# Altium project VIDB.PrjPcb
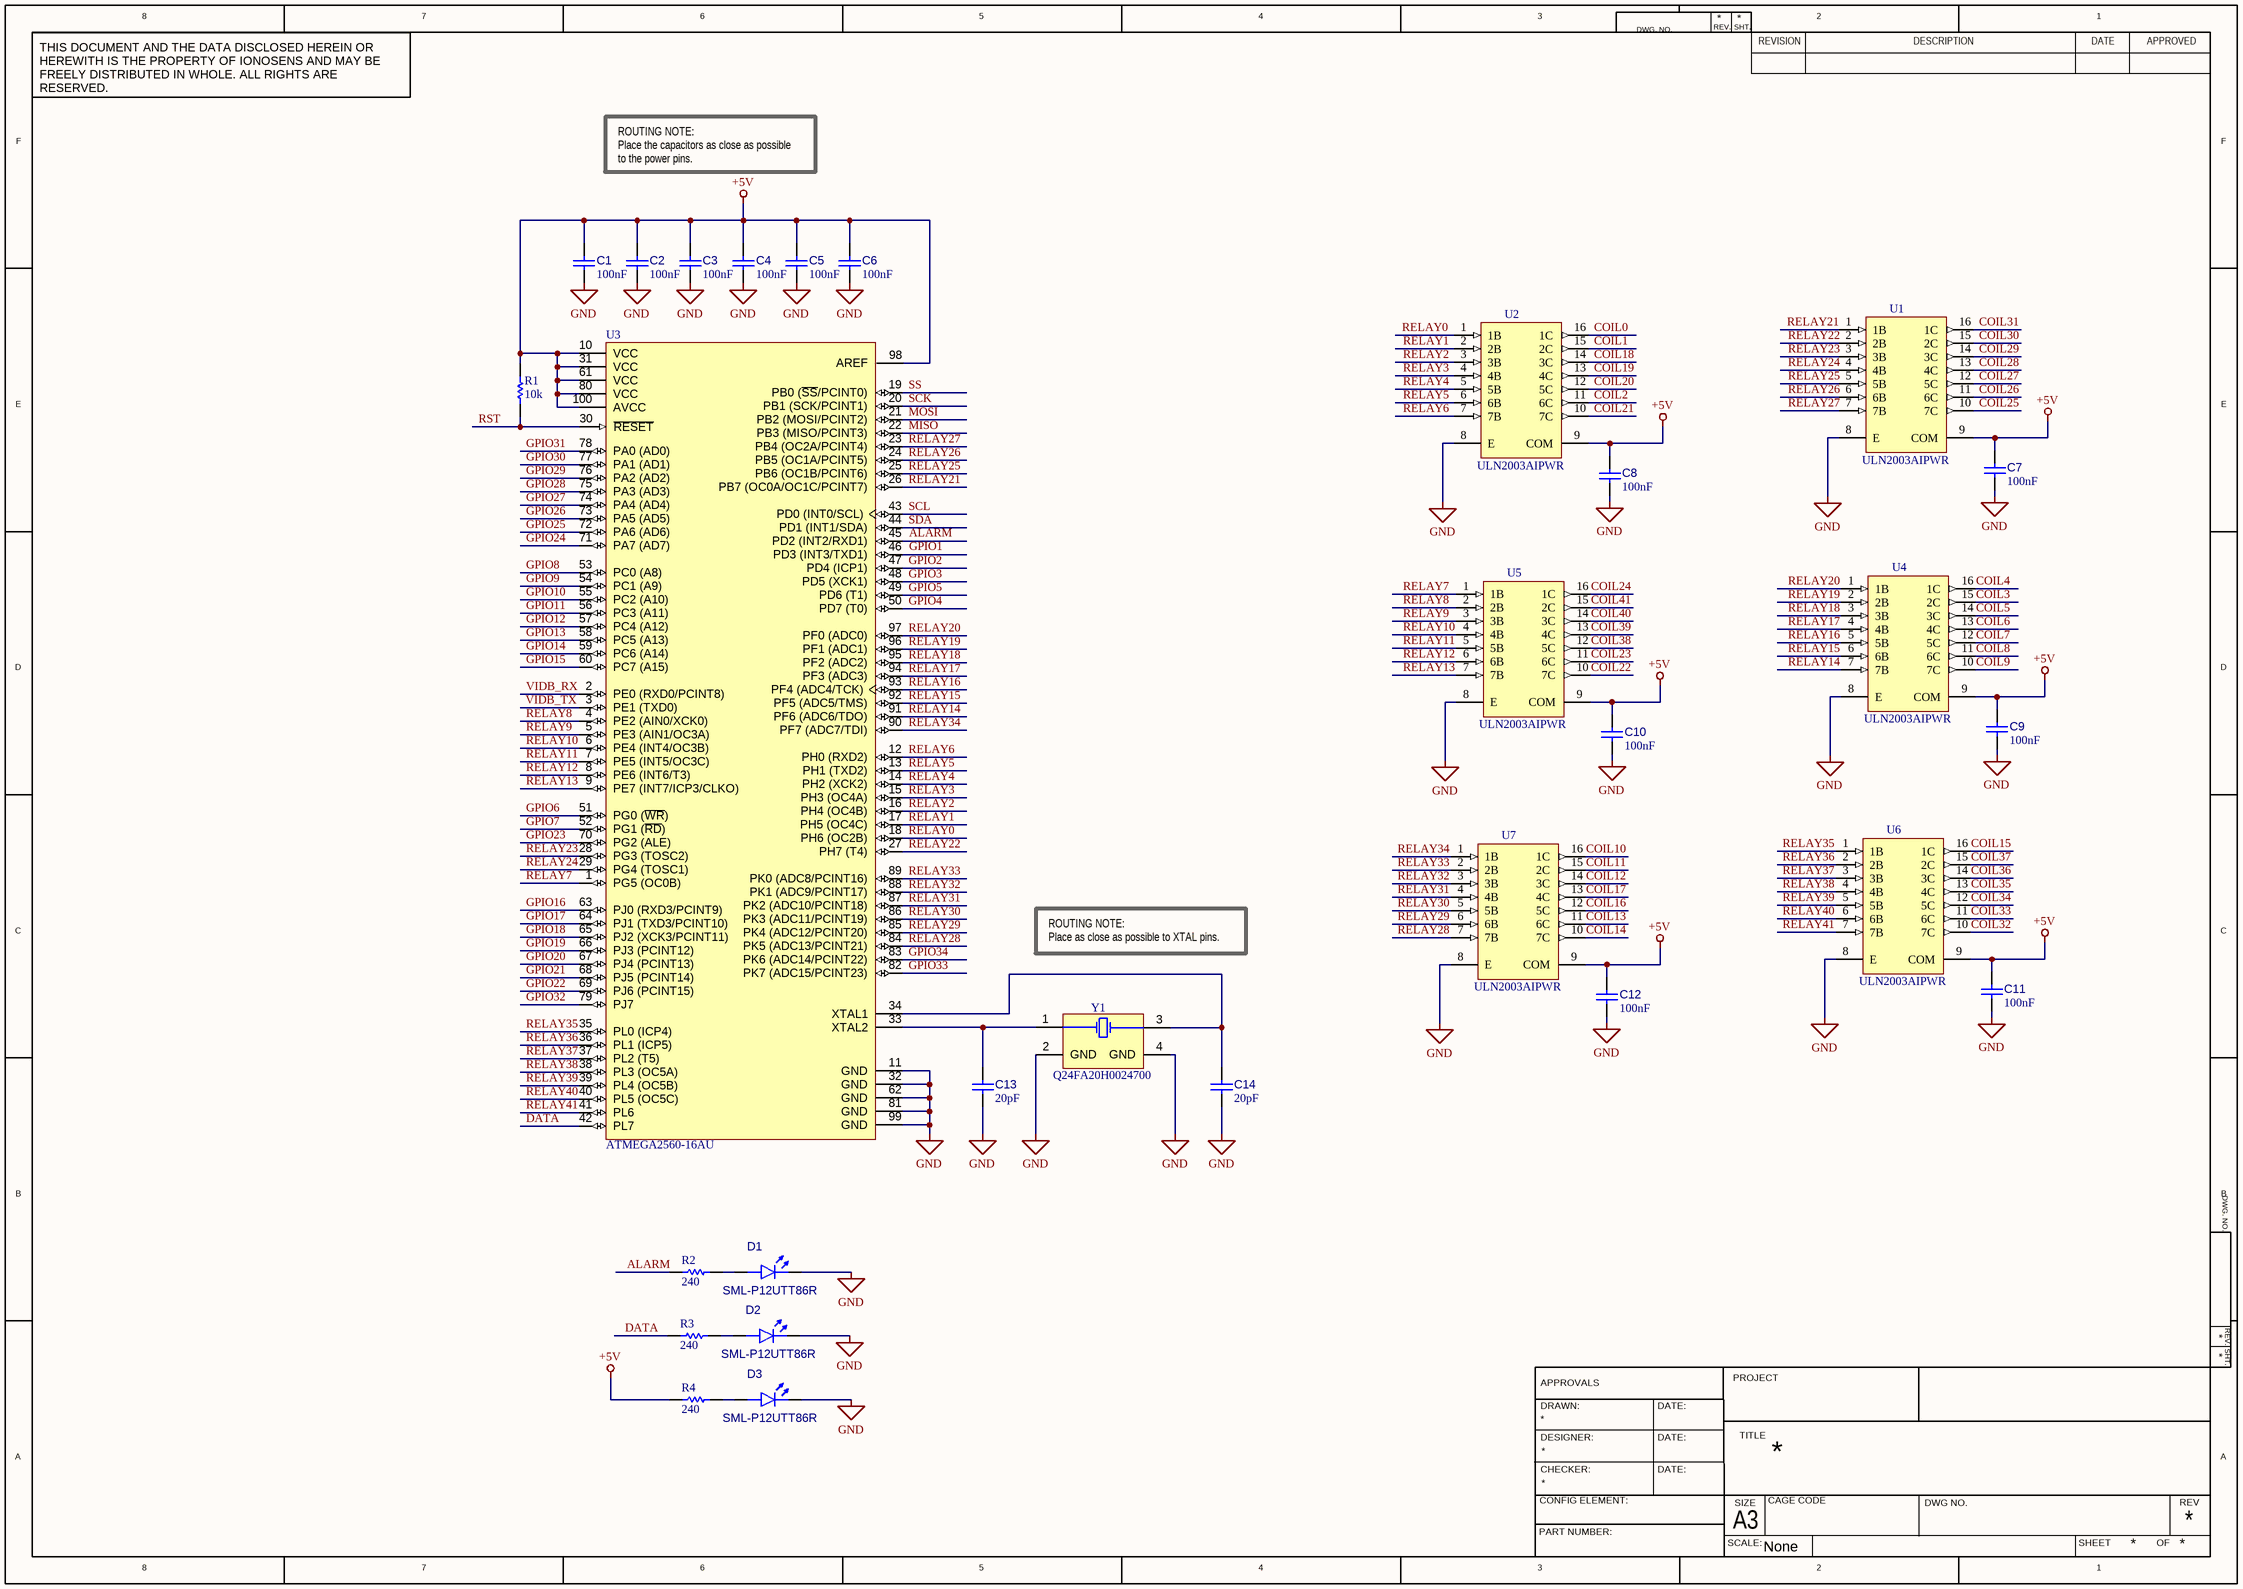
[diagram p0: Sheet1.SchDoc]
4 sheets, 168 parts. Net scope: global (net labels, ports and power ports of the same name join across sheets).
Board file: PCB1.PcbDoc
Sheets:
  Sheet1.SchDoc
  Sheet2.SchDoc
  Sheet4.SchDoc
  Sheet3.SchDoc

## Sheet Sheet1.SchDoc
size 420 x 297 mm; Scale: None

### Parts
C1  value 100nF  [CAPC1005X06M]  (hidden comment: CC0402JRX7R7BB104)
C2  value 100nF  [CAPC1005X06M]  (hidden comment: CC0402JRX7R7BB104)
C3  value 100nF  [CAPC1005X06M]  (hidden comment: CC0402JRX7R7BB104)
C4  value 100nF  [CAPC1005X06M]  (hidden comment: CC0402JRX7R7BB104)
C5  value 100nF  [CAPC1005X06M]  (hidden comment: CC0402JRX7R7BB104)
C6  value 100nF  [CAPC1005X06M]  (hidden comment: CC0402JRX7R7BB104)
C7  value 100nF  [CAPC1005X06M]  (hidden comment: CC0402JRX7R7BB104)
C8  value 100nF  [CAPC1005X06M]  (hidden comment: CC0402JRX7R7BB104)
C9  value 100nF  [CAPC1005X06M]  (hidden comment: CC0402JRX7R7BB104)
C10  value 100nF  [CAPC1005X06M]  (hidden comment: CC0402JRX7R7BB104)
C11  value 100nF  [CAPC1005X06M]  (hidden comment: CC0402JRX7R7BB104)
C12  value 100nF  [CAPC1005X06M]  (hidden comment: CC0402JRX7R7BB104)
C13  value 20pF  [CAPC1005X06M]  (hidden comment: CC0402JRNPO9BN200)
C14  value 20pF  [CAPC1005X06M]  (hidden comment: CC0402JRNPO9BN200)
D1  SML-P12UTT86R  [DIOC1005X02R]
D2  SML-P12UTT86R  [DIOC1005X02R]
D3  SML-P12UTT86R  [DIOC1005X02R]
R1  value 10k  [RESC1005X04M]  (hidden comment: AC0402FR-0710KL)
R2  value 240  [RESC1005X04M]  (hidden comment: AC0402FR-07240RL)
R3  value 240  [RESC1005X04M]  (hidden comment: AC0402FR-07240RL)
R4  value 240  [RESC1005X04M]  (hidden comment: AC0402FR-07240RL)
U1  ULN2003AIPWR  [TSOP65P640X120-16M]
U2  ULN2003AIPWR  [TSOP65P640X120-16M]
U3  ATMEGA2560-16AU  [ATML-100A_M]
U4  ULN2003AIPWR  [TSOP65P640X120-16M]
U5  ULN2003AIPWR  [TSOP65P640X120-16M]
U6  ULN2003AIPWR  [TSOP65P640X120-16M]
U7  ULN2003AIPWR  [TSOP65P640X120-16M]
Y1  Q24FA20H0024700  [FA-20H]

### Nets
+5V: C1.2 C2.2 C3.2 C4.2 C5.2 C6.2 C7.2 C8.2 C9.2 C10.2 C11.2 C12.2 R1.2 R4.1 U1.9(COM) U2.9(COM) U3.10(VCC) U3.31(VCC) U3.61(VCC) U3.80(VCC) U3.98(AREF) U3.100(AVCC) U4.9(COM) U5.9(COM) U6.9(COM) U7.9(COM)
GND: C1.1 C2.1 C3.1 C4.1 C5.1 C6.1 C7.1 C8.1 C9.1 C10.1 C11.1 C12.1 C13.1 C14.1 D1.1(K) D2.1(K) D3.1(K) U1.8(E) U2.8(E) U3.11(GND) U3.32(GND) U3.62(GND) U3.81(GND) U3.99(GND) U4.8(E) U5.8(E) U6.8(E) U7.8(E) Y1.2(GND) Y1.4(GND)
ALARM: R2.1 U3.45(PD2_(INT2/RXD1))
COIL0: U2.16(1C)
COIL1: U2.15(2C)
COIL2: U2.11(6C)
COIL3: U4.15(2C)
COIL4: U4.16(1C)
COIL5: U4.14(3C)
COIL6: U4.13(4C)
COIL7: U4.12(5C)
COIL8: U4.11(6C)
COIL9: U4.10(7C)
COIL10: U7.16(1C)
COIL11: U7.15(2C)
COIL12: U7.14(3C)
COIL13: U7.11(6C)
COIL14: U7.10(7C)
COIL15: U6.16(1C)
COIL16: U7.12(5C)
COIL17: U7.13(4C)
COIL18: U2.14(3C)
COIL19: U2.13(4C)
COIL20: U2.12(5C)
COIL21: U2.10(7C)
COIL22: U5.10(7C)
COIL23: U5.11(6C)
COIL24: U5.16(1C)
COIL25: U1.10(7C)
COIL26: U1.11(6C)
COIL27: U1.12(5C)
COIL28: U1.13(4C)
COIL29: U1.14(3C)
COIL30: U1.15(2C)
COIL31: U1.16(1C)
COIL32: U6.10(7C)
COIL33: U6.11(6C)
COIL34: U6.12(5C)
COIL35: U6.13(4C)
COIL36: U6.14(3C)
COIL37: U6.15(2C)
COIL38: U5.12(5C)
COIL39: U5.13(4C)
COIL40: U5.14(3C)
COIL41: U5.15(2C)
DATA: R3.1 U3.42(PL7)
GPIO1: U3.46(PD3_(INT3/TXD1))
GPIO2: U3.47(PD4_(ICP1))
GPIO3: U3.48(PD5_(XCK1))
GPIO4: U3.50(PD7_(T0))
GPIO5: U3.49(PD6_(T1))
GPIO6: U3.51(PG0_(~{WR}))
GPIO7: U3.52(PG1_(~{RD}))
GPIO8: U3.53(PC0_(A8))
GPIO9: U3.54(PC1_(A9))
GPIO10: U3.55(PC2_(A10))
GPIO11: U3.56(PC3_(A11))
GPIO12: U3.57(PC4_(A12))
GPIO13: U3.58(PC5_(A13))
GPIO14: U3.59(PC6_(A14))
GPIO15: U3.60(PC7_(A15))
GPIO16: U3.63(PJ0_(RXD3/PCINT9))
GPIO17: U3.64(PJ1_(TXD3/PCINT10))
GPIO18: U3.65(PJ2_(XCK3/PCINT11))
GPIO19: U3.66(PJ3_(PCINT12))
GPIO20: U3.67(PJ4_(PCINT13))
GPIO21: U3.68(PJ5_(PCINT14))
GPIO22: U3.69(PJ6_(PCINT15))
GPIO23: U3.70(PG2_(ALE))
GPIO24: U3.71(PA7_(AD7))
GPIO25: U3.72(PA6_(AD6))
GPIO26: U3.73(PA5_(AD5))
GPIO27: U3.74(PA4_(AD4))
GPIO28: U3.75(PA3_(AD3))
GPIO29: U3.76(PA2_(AD2))
GPIO30: U3.77(PA1_(AD1))
GPIO31: U3.78(PA0_(AD0))
GPIO32: U3.79(PJ7)
GPIO33: U3.82(PK7_(ADC15/PCINT23))
GPIO34: U3.83(PK6_(ADC14/PCINT22))
MISO: U3.22(PB3_(MISO/PCINT3))
MOSI: U3.21(PB2_(MOSI/PCINT2))
RELAY0: U2.1(1B) U3.18(PH6_(OC2B))
RELAY1: U2.2(2B) U3.17(PH5_(OC4C))
RELAY2: U2.3(3B) U3.16(PH4_(OC4B))
RELAY3: U2.4(4B) U3.15(PH3_(OC4A))
RELAY4: U2.5(5B) U3.14(PH2_(XCK2))
RELAY5: U2.6(6B) U3.13(PH1_(TXD2))
RELAY6: U2.7(7B) U3.12(PH0_(RXD2))
RELAY7: U3.1(PG5_(OC0B)) U5.1(1B)
RELAY8: U3.4(PE2_(AIN0/XCK0)) U5.2(2B)
RELAY9: U3.5(PE3_(AIN1/OC3A)) U5.3(3B)
RELAY10: U3.6(PE4_(INT4/OC3B)) U5.4(4B)
RELAY11: U3.7(PE5_(INT5/OC3C)) U5.5(5B)
RELAY12: U3.8(PE6_(INT6/T3)) U5.6(6B)
RELAY13: U3.9(PE7_(INT7/ICP3/CLKO)) U5.7(7B)
RELAY14: U3.91(PF6_(ADC6/TDO)) U4.7(7B)
RELAY15: U3.92(PF5_(ADC5/TMS)) U4.6(6B)
RELAY16: U3.93(PF4_(ADC4/TCK)) U4.5(5B)
RELAY17: U3.94(PF3_(ADC3)) U4.4(4B)
RELAY18: U3.95(PF2_(ADC2)) U4.3(3B)
RELAY19: U3.96(PF1_(ADC1)) U4.2(2B)
RELAY20: U3.97(PF0_(ADC0)) U4.1(1B)
RELAY21: U1.1(1B) U3.26(PB7_(OC0A/OC1C/PCINT7))
RELAY22: U1.2(2B) U3.27(PH7_(T4))
RELAY23: U1.3(3B) U3.28(PG3_(TOSC2))
RELAY24: U1.4(4B) U3.29(PG4_(TOSC1))
RELAY25: U1.5(5B) U3.25(PB6_(OC1B/PCINT6))
RELAY26: U1.6(6B) U3.24(PB5_(OC1A/PCINT5))
RELAY27: U1.7(7B) U3.23(PB4_(OC2A/PCINT4))
RELAY28: U3.84(PK5_(ADC13/PCINT21)) U7.7(7B)
RELAY29: U3.85(PK4_(ADC12/PCINT20)) U7.6(6B)
RELAY30: U3.86(PK3_(ADC11/PCINT19)) U7.5(5B)
RELAY31: U3.87(PK2_(ADC10/PCINT18)) U7.4(4B)
RELAY32: U3.88(PK1_(ADC9/PCINT17)) U7.3(3B)
RELAY33: U3.89(PK0_(ADC8/PCINT16)) U7.2(2B)
RELAY34: U3.90(PF7_(ADC7/TDI)) U7.1(1B)
RELAY35: U3.35(PL0_(ICP4)) U6.1(1B)
RELAY36: U3.36(PL1_(ICP5)) U6.2(2B)
RELAY37: U3.37(PL2_(T5)) U6.3(3B)
RELAY38: U3.38(PL3_(OC5A)) U6.4(4B)
RELAY39: U3.39(PL4_(OC5B)) U6.5(5B)
RELAY40: U3.40(PL5_(OC5C)) U6.6(6B)
RELAY41: U3.41(PL6) U6.7(7B)
RST: R1.1 U3.30(~{RESET})
SCK: U3.20(PB1_(SCK/PCINT1))
SCL: U3.43(PD0_(INT0/SCL))
SDA: U3.44(PD1_(INT1/SDA))
SS: U3.19(PB0_(~{SS}/PCINT0))
VIDB_RX: U3.2(PE0_(RXD0/PCINT8))
VIDB_TX: U3.3(PE1_(TXD0))
NetC13_2: C13.2 U3.33(XTAL2) Y1.1(X1)
NetC14_2: C14.2 U3.34(XTAL1) Y1.3(X2)
NetD1_2: D1.2(A) R2.2
NetD2_2: D2.2(A) R3.2
NetD3_2: D3.2(A) R4.2

### Notes on the sheet
- ROUTING NOTE:
  Place the capacitors as close as possible to the power pins.
- ROUTING NOTE:
  Place as close as possible to XTAL pins.
- 8
- 7
- 6
- 5
- 4
- 3
- DWG. NO.
- REV.
- SHT.
- REVISION
- 2
- DESCRIPTION
- DATE
- 1
- APPROVED
- THIS DOCUMENT AND THE DATA DISCLOSED HEREIN OR HEREWITH IS THE PROPERTY OF IONOSENS AND MAY BE FREELY DISTRIBUTED IN WHOLE. ALL RIGHTS ARE RESERVED.
- F
- E
- D
- C
- B
- DRAWN:
- APPROVALS
- DATE:
- PROJECT
- A
- CHECKER:
- DESIGNER:
- TITLE
- PART NUMBER:
- CONFIG ELEMENT:
- SCALE:
- A3
- SIZE
- CAGE CODE
- DWG NO.
- SHEET
- OF
- REV

### Library data of the parts
C1-C12 = C01-0402-01-00001-1: Cap Ceramic 100nF 50V X7R 5% SMD 0402 125°C; Manufacturer: YAGEO; Voltage Rating: 16V; Case/Package: 0402; Capacitor Type: Ceramic; Min Operating Temperature: -55°C; Width: 508µm; Length: 1mm; Tolerance: 5%; Dielectric: X7R; RoHS Compliant: Yes; Pins: 2; Composition: Ceramic; Depth: 500µm; Voltage Rating (DC): 16V; Mount: Surface Mount; Mounting Technology: Surface Mount; Termination: SMD/SMT; Manufacturer P/N: CC0402JRX7R7BB104; Thickness: 558.8µm; Max Operating Temperature: 125°C
C13 C14 = C01-0402-01-00008-1: Cap Ceramic 20pF 50V C0G 5% SMD 0402 125°C; Manufacturer: YAGEO; Dielectric: COG; Case/Package: 0402; Tolerance: 5%; Thickness: 558.8µm; Termination: SMD/SMT; Manufacturer P/N: CC0402JRNPO9BN200; Voltage Rating: 50V; Length: 990.6µm; Depth: 500µm; Width: 508µm; Min Operating Temperature: -55°C; Mount: Surface Mount; Voltage Rating (DC): 50V; Pins: 2; Capacitor Type: Ceramic; RoHS Compliant: Yes; Composition: Ceramic; Mounting Technology: Surface Mount; Max Operating Temperature: 125°C
D1-D3 = D01-0402-01-00001-1: Led red 0402; Manufacturer: ROHM; Number of LEDs: 1; Max Power Dissipation: 52mW; Luminous Intensity: 85 mcd; Dominant Wavelength: 620 nm; Lens Style: Rectangular, Square; Forward Current: 20 mA; Forward Voltage: 2V; Mounting Technology: SMD; Case/Package: 0402; Min Operating Temperature: -40°C; Max Operating Temperature: 85°C; Manufacturer P/N: SML-P12UTT86R; Colour: red; RoHS Compliant: Yes; Pins: 2
R1 = R01-0402-01-00169-2: RES SMD 10K OHM 1% 1/16W 0402; Manufacturer: Yageo; Temperature Coefficient: 100 ppm/ºC; Power Rating: 62.5mW; Voltage Rating: 50V; Length: 990.6µm; Height: 370µm; Min Operating Temperature: -55°C; Case/Package: 0402; Features: Automotive AEC-Q200, Moisture Resistant; Packaging: Tape & Reel; Width: 508µm; Manufacturer P/N: AC0402FR-0710KL; RoHS: Yes; Max Operating Temperature: 155°C; Tolerance: 1%; Composition: Thick Film; Number of Terminations: 2
R2-R4 = R01-0402-01-00437-2: RES SMD 240 OHM 1% 1/16W 0402; Manufacturer: Yageo; Temperature Coefficient: 100 ppm/ºC; Power Rating: 62.5mW; Voltage Rating: 50V; Packaging: Tape & Reel; Manufacturer P/N: AC0402FR-07240RL; Height: 370µm; Case/Package: 0402; Composition: Thick Film; Max Operating Temperature: 155°C; Number of Terminations: 2; RoHS: Yes; Min Operating Temperature: -55°C; Tolerance: 1%; Width: 508µm; Length: 990.6µm; Features: Automotive AEC-Q200, Moisture Resistant
U1 U2 U4-U7 = CMP-0005-0001-00001-1: 50-V, 7-ch darlington transistor array, -40 to 105C 16-TSSOP -40 to 105; Manufacturer: Texas Instruments; Voltage Rating: 50V; Min Operating Temperature: 105°C; RoHS Compliant: yes; Pins: 16; Case/Package: TSSOP; Mounting Technology: SMD; Length: 5mm; Manufacturer P/N: ULN2003AIPWR; Height: 1.2mm; Max Operating Temperature: -40°C; Width: 4.4mm
U3 = U01-0007-01-00000-1: AVR ATmega Microcontroller 8-bit 16MHz 256KB FLASH TQFP100; Manufacturer: Microchip; Oscillator Type: External; Interface: I2C, SPI, UART; Minimum Supply Voltage: 4.5V; Peripherals: Brown-out Detect/Reset, POR, PWM, WDT; Number of A/D: 1 AD / 16 channels; Watchdog Timer: Yes; Number of I/O: 86; RAM Size: 8KB; Max Supply Voltage: 5.5V; Max Operating Temperature: 85°C; Manufacturer P/N: ATMEGA2560-16AU; Memory Size: 256KB; Mounting Technology: SMD; Memory Type: FLASH; Pins: 100; Height: 1.2mm; Case/Package: A; RoHS: Yes; Min Operating Temperature: -40°C; Max Frequency: 16MHz; Number of Programmable I/O: 86; Contact Plating: Tin; Core Architecture: AVR; Frequency: 16MHz; Width: 16.25mm
Y1 = Y01-0001-01-00000-11: 16MHz ±10ppm 16pF 80Ω SMD-2520_4P; Manufacturer: SEIKO-EPSON; ESR: 80; RoHS Compliant: yes; Min Operating Temperature: -40°C; Load Capacitance: 16pF; Mounting Technology: SMD; Pins: 4; Case/Package: SMD-2520_4P; Max Operating Temperature: 85°C; Frequency: 16MHz; Manufacturer P/N: Q24FA20H0024700

## Sheet Sheet2.SchDoc
size 420 x 297 mm
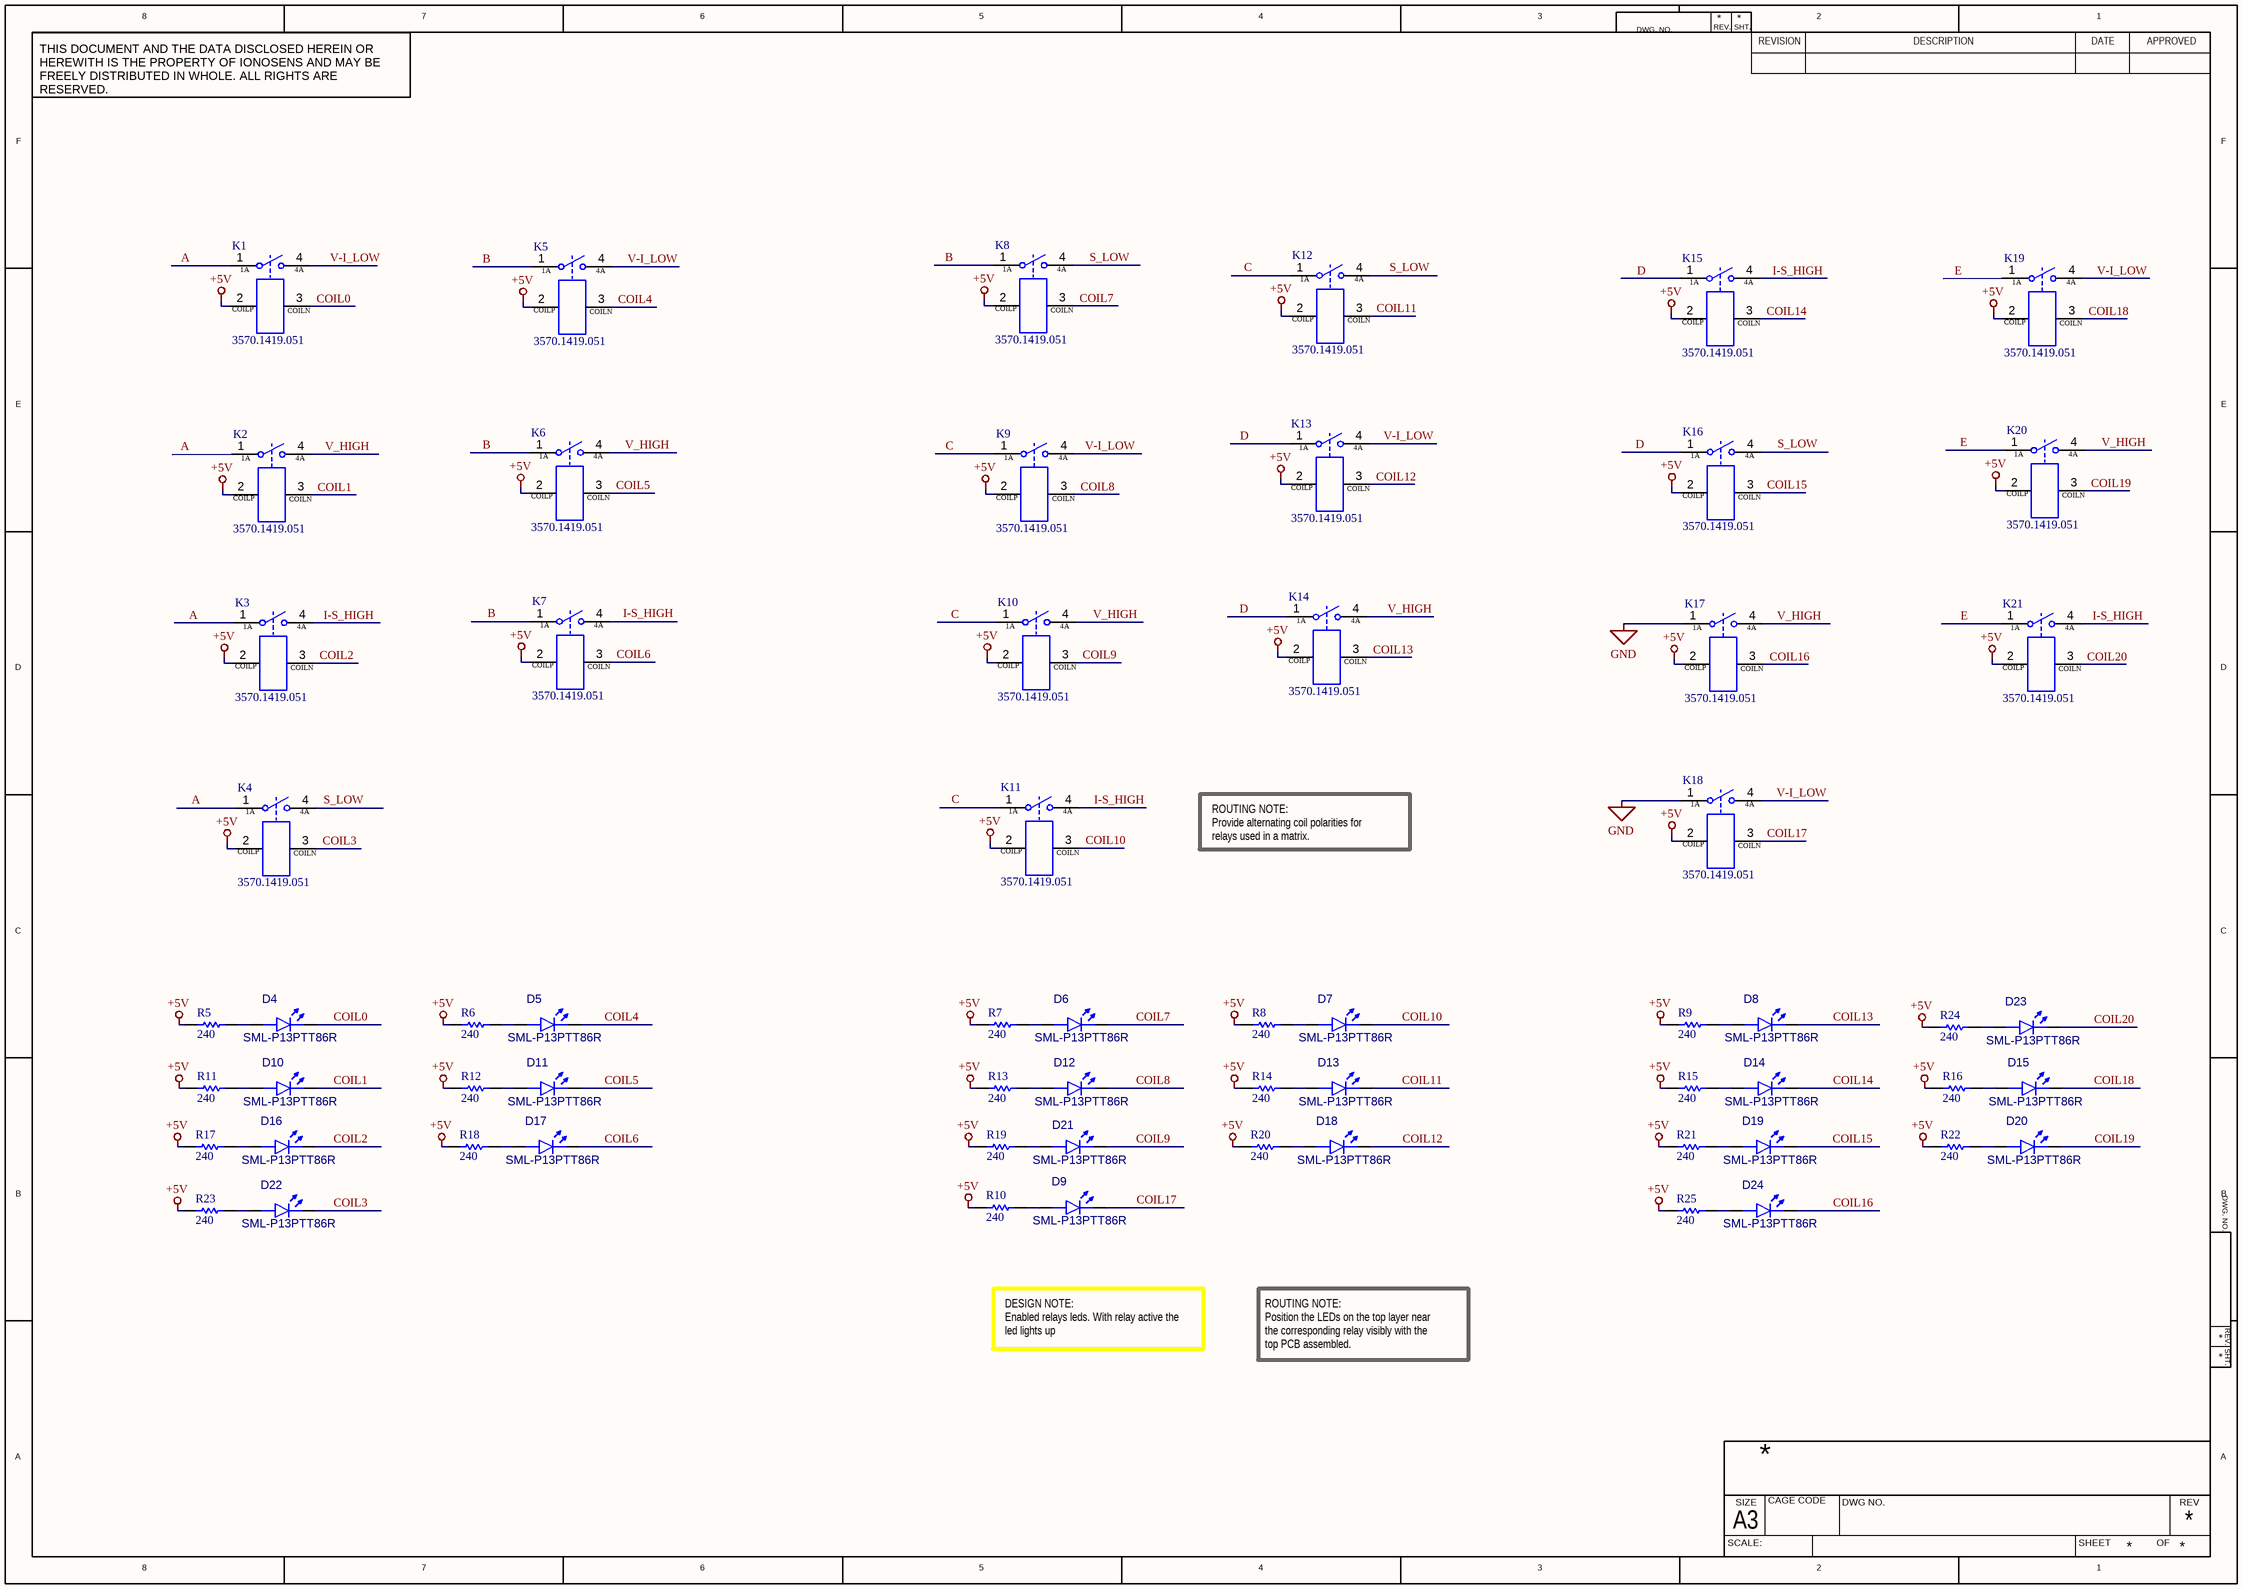
[diagram p1: Sheet2.SchDoc]

### Parts
D4  SML-P13PTT86R  [DIOC1005X02R]
D5  SML-P13PTT86R  [DIOC1005X02R]
D6  SML-P13PTT86R  [DIOC1005X02R]
D7  SML-P13PTT86R  [DIOC1005X02R]
D8  SML-P13PTT86R  [DIOC1005X02R]
D9  SML-P13PTT86R  [DIOC1005X02R]
D10  SML-P13PTT86R  [DIOC1005X02R]
D11  SML-P13PTT86R  [DIOC1005X02R]
D12  SML-P13PTT86R  [DIOC1005X02R]
D13  SML-P13PTT86R  [DIOC1005X02R]
D14  SML-P13PTT86R  [DIOC1005X02R]
D15  SML-P13PTT86R  [DIOC1005X02R]
D16  SML-P13PTT86R  [DIOC1005X02R]
D17  SML-P13PTT86R  [DIOC1005X02R]
D18  SML-P13PTT86R  [DIOC1005X02R]
D19  SML-P13PTT86R  [DIOC1005X02R]
D20  SML-P13PTT86R  [DIOC1005X02R]
D21  SML-P13PTT86R  [DIOC1005X02R]
D22  SML-P13PTT86R  [DIOC1005X02R]
D23  SML-P13PTT86R  [DIOC1005X02R]
D24  SML-P13PTT86R  [DIOC1005X02R]
K1  3570.1419.051  [3570.1419]
K2  3570.1419.051  [3570.1419]
K3  3570.1419.051  [3570.1419]
K4  3570.1419.051  [3570.1419]
K5  3570.1419.051  [3570.1419]
K6  3570.1419.051  [3570.1419]
K7  3570.1419.051  [3570.1419]
K8  3570.1419.051  [3570.1419]
K9  3570.1419.051  [3570.1419]
K10  3570.1419.051  [3570.1419]
K11  3570.1419.051  [3570.1419]
K12  3570.1419.051  [3570.1419]
K13  3570.1419.051  [3570.1419]
K14  3570.1419.051  [3570.1419]
K15  3570.1419.051  [3570.1419]
K16  3570.1419.051  [3570.1419]
K17  3570.1419.051  [3570.1419]
K18  3570.1419.051  [3570.1419]
K19  3570.1419.051  [3570.1419]
K20  3570.1419.051  [3570.1419]
K21  3570.1419.051  [3570.1419]
R5  value 240  [RESC1005X04M]  (hidden comment: AC0402FR-07240RL)
R6  value 240  [RESC1005X04M]  (hidden comment: AC0402FR-07240RL)
R7  value 240  [RESC1005X04M]  (hidden comment: AC0402FR-07240RL)
R8  value 240  [RESC1005X04M]  (hidden comment: AC0402FR-07240RL)
R9  value 240  [RESC1005X04M]  (hidden comment: AC0402FR-07240RL)
R10  value 240  [RESC1005X04M]  (hidden comment: AC0402FR-07240RL)
R11  value 240  [RESC1005X04M]  (hidden comment: AC0402FR-07240RL)
R12  value 240  [RESC1005X04M]  (hidden comment: AC0402FR-07240RL)
R13  value 240  [RESC1005X04M]  (hidden comment: AC0402FR-07240RL)
R14  value 240  [RESC1005X04M]  (hidden comment: AC0402FR-07240RL)
R15  value 240  [RESC1005X04M]  (hidden comment: AC0402FR-07240RL)
R16  value 240  [RESC1005X04M]  (hidden comment: AC0402FR-07240RL)
R17  value 240  [RESC1005X04M]  (hidden comment: AC0402FR-07240RL)
R18  value 240  [RESC1005X04M]  (hidden comment: AC0402FR-07240RL)
R19  value 240  [RESC1005X04M]  (hidden comment: AC0402FR-07240RL)
R20  value 240  [RESC1005X04M]  (hidden comment: AC0402FR-07240RL)
R21  value 240  [RESC1005X04M]  (hidden comment: AC0402FR-07240RL)
R22  value 240  [RESC1005X04M]  (hidden comment: AC0402FR-07240RL)
R23  value 240  [RESC1005X04M]  (hidden comment: AC0402FR-07240RL)
R24  value 240  [RESC1005X04M]  (hidden comment: AC0402FR-07240RL)
R25  value 240  [RESC1005X04M]  (hidden comment: AC0402FR-07240RL)

### Nets
+5V: K1.2(COILP) K2.2(COILP) K3.2(COILP) K4.2(COILP) K5.2(COILP) K6.2(COILP) K7.2(COILP) K8.2(COILP) K9.2(COILP) K10.2(COILP) K11.2(COILP) K12.2(COILP) K13.2(COILP) K14.2(COILP) K15.2(COILP) K16.2(COILP) K17.2(COILP) K18.2(COILP) K19.2(COILP) K20.2(COILP) K21.2(COILP) R5.1 R6.1 R7.1 R8.1 R9.1 R10.1 R11.1 R12.1 R13.1 R14.1 R15.1 R16.1 R17.1 R18.1 R19.1 R20.1 R21.1 R22.1 R23.1 R24.1 R25.1
GND: K17.1(1A) K18.1(1A)
A: K1.1(1A) K2.1(1A) K3.1(1A) K4.1(1A)
B: K5.1(1A) K6.1(1A) K7.1(1A) K8.1(1A)
C: K9.1(1A) K10.1(1A) K11.1(1A) K12.1(1A)
COIL0: D4.1(K) K1.3(COILN)
COIL1: D10.1(K) K2.3(COILN)
COIL2: D16.1(K) K3.3(COILN)
COIL3: D22.1(K) K4.3(COILN)
COIL4: D5.1(K) K5.3(COILN)
COIL5: D11.1(K) K6.3(COILN)
COIL6: D17.1(K) K7.3(COILN)
COIL7: D6.1(K) K8.3(COILN)
COIL8: D12.1(K) K9.3(COILN)
COIL9: D21.1(K) K10.3(COILN)
COIL10: D7.1(K) K11.3(COILN)
COIL11: D13.1(K) K12.3(COILN)
COIL12: D18.1(K) K13.3(COILN)
COIL13: D8.1(K) K14.3(COILN)
COIL14: D14.1(K) K15.3(COILN)
COIL15: D19.1(K) K16.3(COILN)
COIL16: D24.1(K) K17.3(COILN)
COIL17: D9.1(K) K18.3(COILN)
COIL18: D15.1(K) K19.3(COILN)
COIL19: D20.1(K) K20.3(COILN)
COIL20: D23.1(K) K21.3(COILN)
D: K13.1(1A) K14.1(1A) K15.1(1A) K16.1(1A)
E: K19.1(1A) K20.1(1A) K21.1(1A)
I-S_HIGH: K3.4(4A) K7.4(4A) K11.4(4A) K15.4(4A) K21.4(4A)
S_LOW: K4.4(4A) K8.4(4A) K12.4(4A) K16.4(4A)
V-I_LOW: K1.4(4A) K5.4(4A) K9.4(4A) K13.4(4A) K18.4(4A) K19.4(4A)
V_HIGH: K2.4(4A) K6.4(4A) K10.4(4A) K14.4(4A) K17.4(4A) K20.4(4A)
NetD4_2: D4.2(A) R5.2
NetD5_2: D5.2(A) R6.2
NetD6_2: D6.2(A) R7.2
NetD7_2: D7.2(A) R8.2
NetD8_2: D8.2(A) R9.2
NetD9_2: D9.2(A) R10.2
NetD10_2: D10.2(A) R11.2
NetD11_2: D11.2(A) R12.2
NetD12_2: D12.2(A) R13.2
NetD13_2: D13.2(A) R14.2
NetD14_2: D14.2(A) R15.2
NetD15_2: D15.2(A) R16.2
NetD16_2: D16.2(A) R17.2
NetD17_2: D17.2(A) R18.2
NetD18_2: D18.2(A) R20.2
NetD19_2: D19.2(A) R21.2
NetD20_2: D20.2(A) R22.2
NetD21_2: D21.2(A) R19.2
NetD22_2: D22.2(A) R23.2
NetD23_2: D23.2(A) R24.2
NetD24_2: D24.2(A) R25.2

### Notes on the sheet
- ROUTING NOTE:
  Provide alternating coil polarities for relays used in a matrix.
- DESIGN NOTE:
  Enabled relays leds. With relay active the led lights up
- ROUTING NOTE:
  Position the LEDs on the top layer near the corresponding relay visibly with the top PCB assembled.
- 8
- 7
- 6
- 5
- 4
- 3
- DWG. NO.
- REV.
- SHT.
- REVISION
- 2
- DESCRIPTION
- DATE
- 1
- APPROVED
- THIS DOCUMENT AND THE DATA DISCLOSED HEREIN OR HEREWITH IS THE PROPERTY OF IONOSENS AND MAY BE FREELY DISTRIBUTED IN WHOLE. ALL RIGHTS ARE RESERVED.
- F
- E
- D
- C
- B
- A
- SCALE:
- A3
- SIZE
- CAGE CODE
- DWG NO.
- SHEET
- OF
- REV

### Library data of the parts
D4-D24 = D01-0402-01-00000-1: Led green 0402; Manufacturer: ROHM; Forward Voltage: 2.1V; Max Power Dissipation: 52mW; Forward Current: 20 mA; Number of LEDs: 1; Dominant Wavelength: 560 nm; Luminous Intensity: 10 mcd; Lens Style: Rectangular, Square; Min Operating Temperature: -40°C; Mounting Technology: SMD; Colour: Green; Manufacturer P/N: SML-P13PTT86R; Max Operating Temperature: 85°C; Pins: 2; RoHS Compliant: Yes; Case/Package: 0402
K1-K21 = K01-0008-01-00008-1: Reed Relay, Mini SIP, 5 VDC; 1 Form A, 15W, 200 VDC, 1.25A; Manufacturer: Comus; Number of Terminal: 4; Contact Current Rating: 1A; Coil Current: 10mA; Switching Voltage: 200V; Rise time: 0s; Contact Resistence: 0.15; Coil resitence: 500; Operate Time: 350µs; Coil Voltage (DC): 5V; Insulation Resistance: 0; Release Time: 100µs; Manufacturer P/N: 3570.1419.051; Mounting Technology: TH; Contact Material: -; Relay Type: Reed; Width: 15.24mm; Contact Form: 1A; Packaging: SIP; Switching Current: 1A; Pins: 4; Case/Package: SIP; Coil Type: -; Min Operating Temperature: -40°C; RoHS: Yes; Height: 6.98mm; Max Operating Temperature: 85°C
R5-R25 = R01-0402-01-00437-2: as R2 on sheet Sheet1; Packaging: Tape & Reel; Manufacturer P/N: AC0402FR-07240RL; Height: 370µm; Case/Package: 0402; Composition: Thick Film; Max Operating Temperature: 155°C; Number of Terminations: 2; RoHS: Yes; Min Operating Temperature: -55°C; Tolerance: 1%; Width: 508µm; Length: 990.6µm; Features: Automotive AEC-Q200, Moisture Resistant

## Sheet Sheet4.SchDoc
size 420 x 297 mm
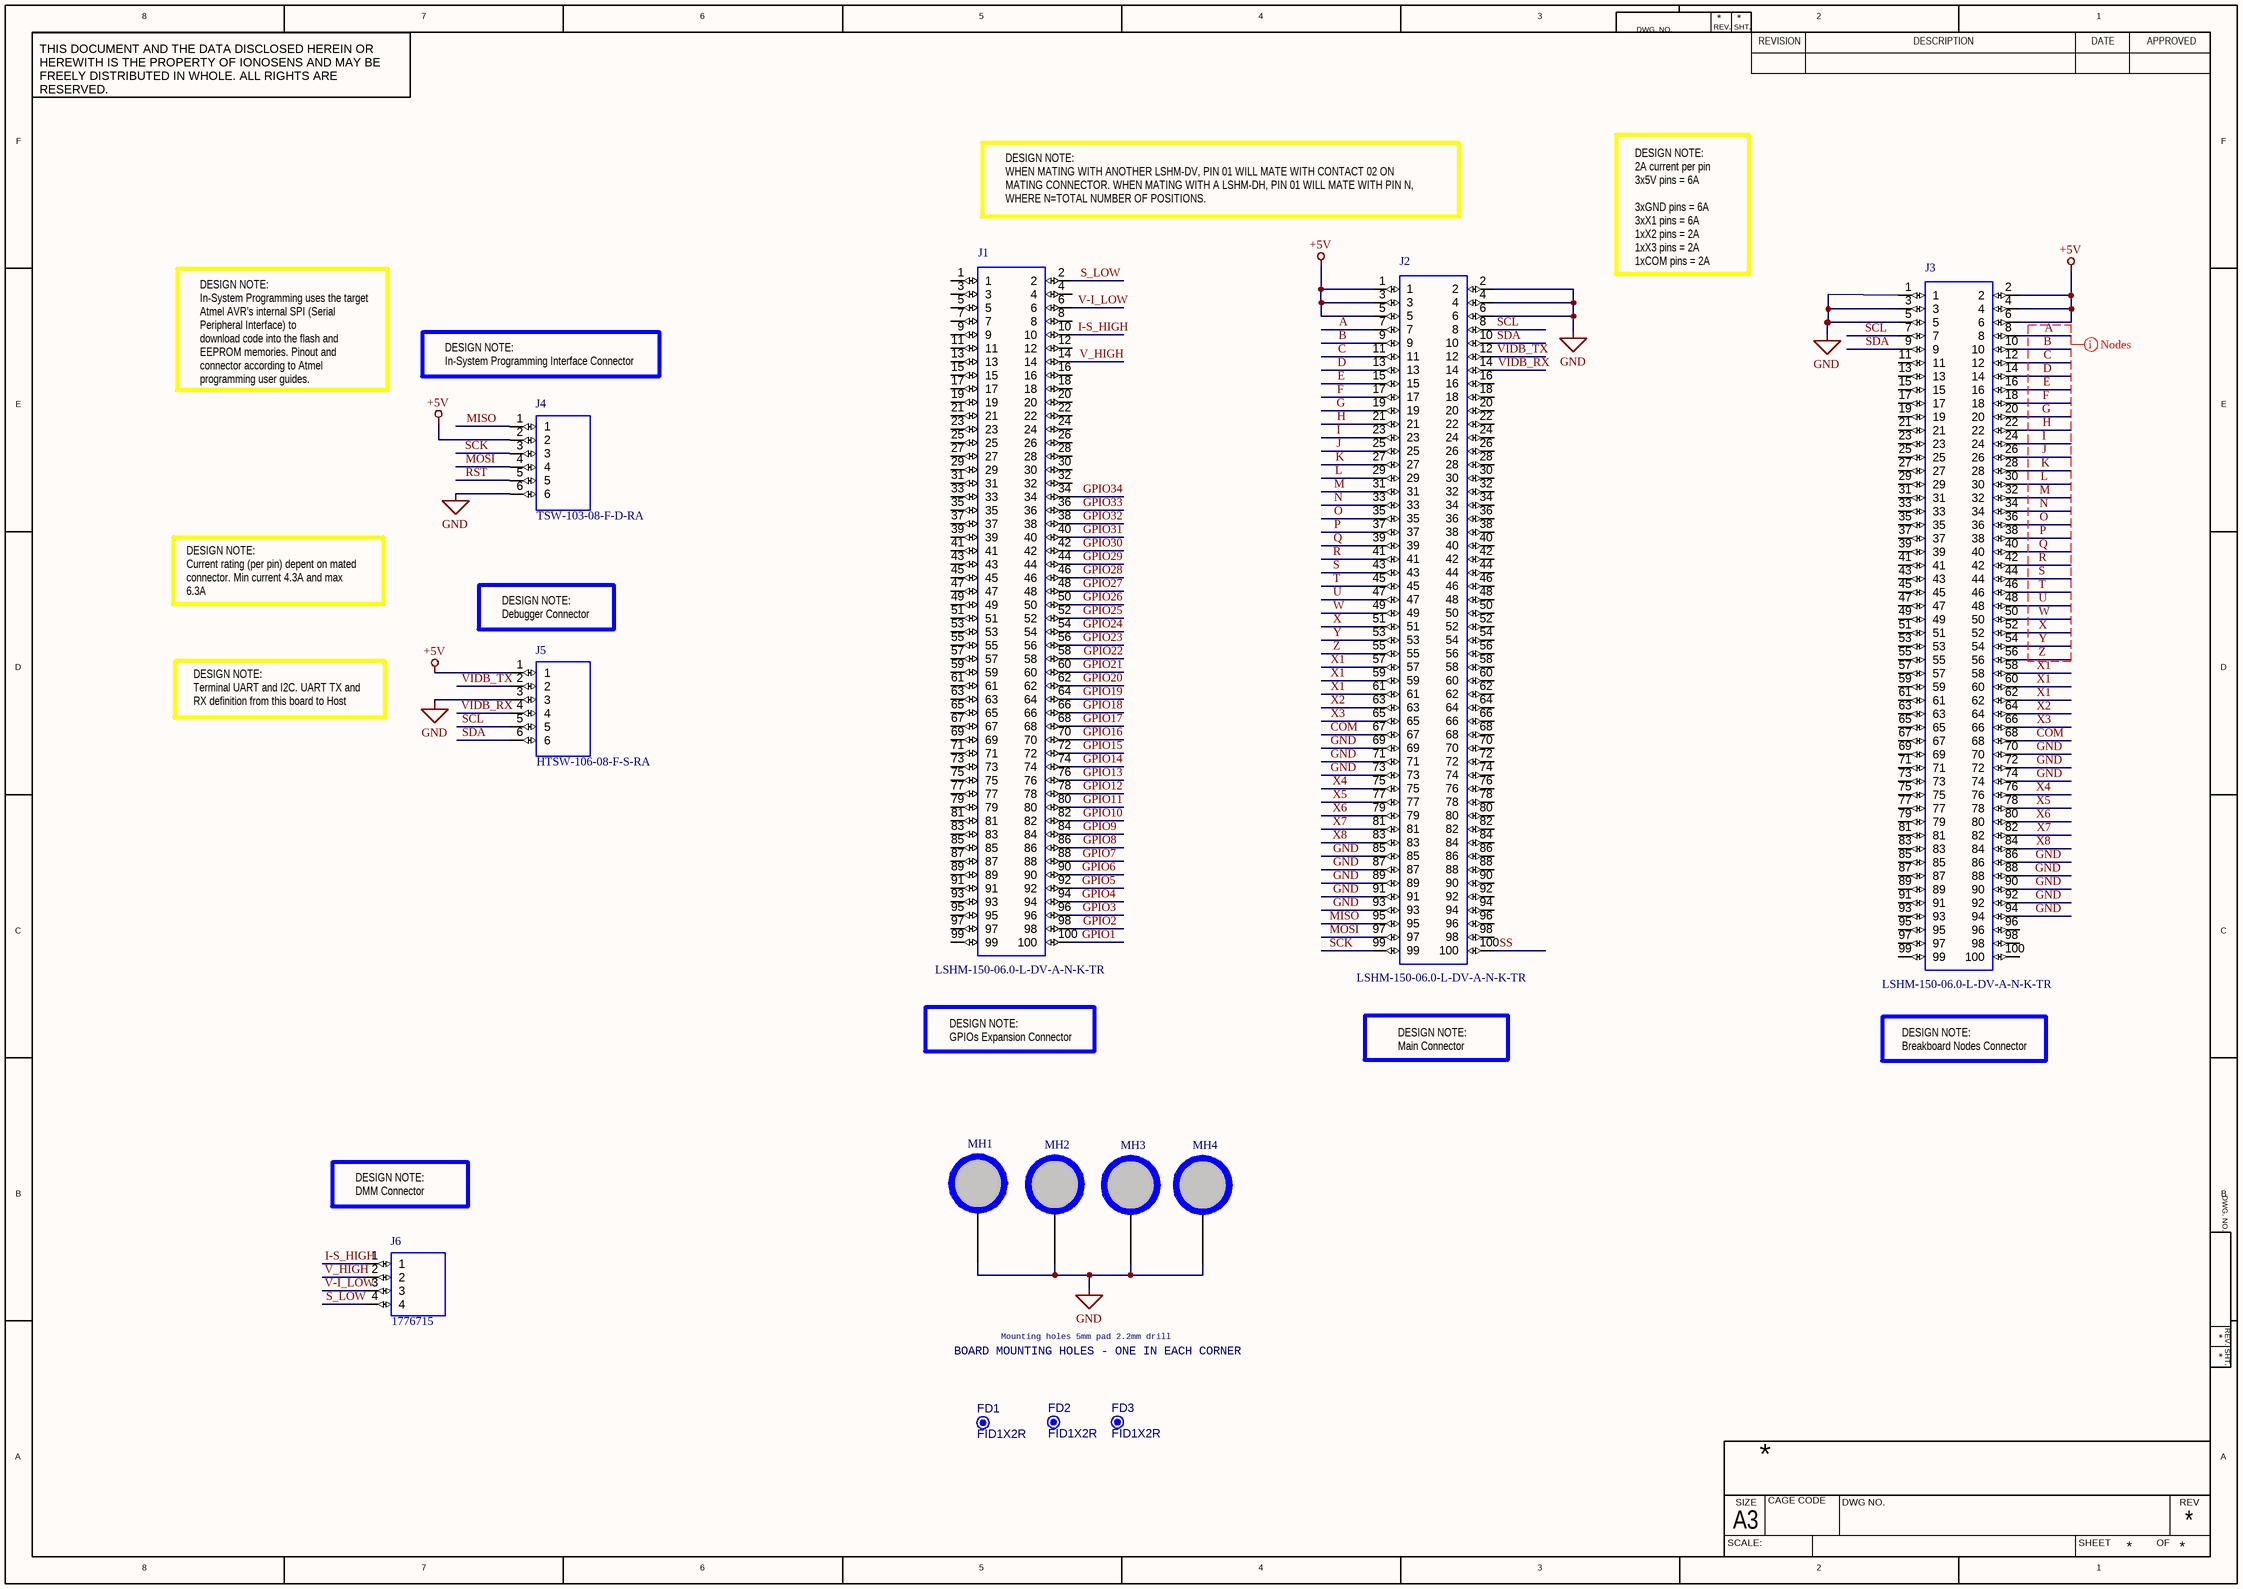
[diagram p2: Sheet4.SchDoc]

### Parts
FD1  FID1X2R  [FID1X2R]  (no BOM)
FD2  FID1X2R  [FID1X2R]  (no BOM)
FD3  FID1X2R  [FID1X2R]  (no BOM)
J1  LSHM-150-06.0-L-DV-A-N-K-TR  [LSHM_150_06_0_L_DV_A_N_K_TR]
J2  LSHM-150-06.0-L-DV-A-N-K-TR  [LSHM_150_06_0_L_DV_A_N_K_TR]
J3  LSHM-150-06.0-L-DV-A-N-K-TR  [LSHM_150_06_0_L_DV_A_N_K_TR]
J4  TSW-103-08-F-D-RA  [TSW-103-08-F-D-RA]
J5  HTSW-106-08-F-S-RA  [TSW-106-08-F-S-RA]
J6  1776715  [1776715]
MH1  C500h220  [C500h220z368]  (value not drawn)
MH2  C500h220  [C500h220z368]  (value not drawn)
MH3  C500h220  [C500h220z368]  (value not drawn)
MH4  C500h220  [C500h220z368]  (value not drawn)

### Nets
+5V: J2.1 J2.3 J2.5 J3.2 J3.4 J3.6 J4.2 J5.1
GND: J2.2 J2.4 J2.6 J2.69 J2.71 J2.73 J2.85 J2.87 J2.89 J2.91 J2.93 J3.1 J3.3 J3.5 J3.70 J3.72 J3.74 J3.86 J3.88 J3.90 J3.92 J3.94 J4.6 J5.3 MH1.1 MH2.1 MH3.1 MH4.1
A: J2.7 J3.8
B: J2.9 J3.10
C: J2.11 J3.12
COM: J2.67 J3.68
D: J2.13 J3.14
E: J2.15 J3.16
F: J2.17 J3.18
G: J2.19 J3.20
GPIO1: J1.100
GPIO2: J1.98
GPIO3: J1.96
GPIO4: J1.94
GPIO5: J1.92
GPIO6: J1.90
GPIO7: J1.88
GPIO8: J1.86
GPIO9: J1.84
GPIO10: J1.82
GPIO11: J1.80
GPIO12: J1.78
GPIO13: J1.76
GPIO14: J1.74
GPIO15: J1.72
GPIO16: J1.70
GPIO17: J1.68
GPIO18: J1.66
GPIO19: J1.64
GPIO20: J1.62
GPIO21: J1.60
GPIO22: J1.58
GPIO23: J1.56
GPIO24: J1.54
GPIO25: J1.52
GPIO26: J1.50
GPIO27: J1.48
GPIO28: J1.46
GPIO29: J1.44
GPIO30: J1.42
GPIO31: J1.40
GPIO32: J1.38
GPIO33: J1.36
GPIO34: J1.34
H: J2.21 J3.22
I: J2.23 J3.24
I-S_HIGH: J1.10 J6.1
J: J2.25 J3.26
K: J2.27 J3.28
L: J2.29 J3.30
M: J2.31 J3.32
MISO: J2.95 J4.1
MOSI: J2.97 J4.4
N: J2.33 J3.34
O: J2.35 J3.36
P: J2.37 J3.38
Q: J2.39 J3.40
R: J2.41 J3.42
RST: J4.5
S: J2.43 J3.44
S_LOW: J1.2 J6.4
SCK: J2.99 J4.3
SCL: J2.8 J3.7 J5.5
SDA: J2.10 J3.9 J5.6
SS: J2.100
T: J2.45 J3.46
U: J2.47 J3.48
V-I_LOW: J1.6 J6.3
V_HIGH: J1.14 J6.2
VIDB_RX: J2.14 J5.4
VIDB_TX: J2.12 J5.2
W: J2.49 J3.50
X: J2.51 J3.52
X1: J2.57 J2.59 J2.61 J3.58 J3.60 J3.62
X2: J2.63 J3.64
X3: J2.65 J3.66
X4: J2.75 J3.76
X5: J2.77 J3.78
X6: J2.79 J3.80
X7: J2.81 J3.82
X8: J2.83 J3.84
Y: J2.53 J3.54
Z: J2.55 J3.56

Not connected (* = marked no-connect by the designer): J1 1 3 4 5 7 8 9 11 12 13 15 16 17 18 19 20 21 22 23 24 25 26 27 28 29 30 31 32 33 35 37 39 41 43 45 47 49 51 53 55 57 59 61 63 65 67 69 71 73 75 77 79 81 83 85 87 89 91 93 95 97 99; J2 16 18 20 22 24 26 28 30 32 34 36 38 40 42 44 46 48 50 52 54 56 58 60 62 64 66 68 70 72 74 76 78 80 82 84 86 88 90 92 94 96 98; J3 11 13 15 17 19 21 23 25 27 29 31 33 35 37 39 41 43 45 47 49 51 53 55 57 59 61 63 65 67 69 71 73 75 77 79 81 83 85 87 89 91 93 95 96 97 98 99 100

### Layout directives
net class Nodes: A, B, C, D, E, F, G, H, I, J, K, L, M, N, O, P, Q, R, S, T, U, W, X, Y, Z

### Notes on the sheet
- DESIGN NOTE:
  WHEN MATING WITH ANOTHER LSHM-DV, PIN 01 WILL MATE WITH CONTACT 02 ON
  MATING CONNECTOR. WHEN MATING WITH A LSHM-DH, PIN 01 WILL MATE WITH PIN N,
  WHERE N=TOTAL NUMBER OF POSITIONS.
- DESIGN NOTE:
  2A current per pin
  3x5V pins = 6A
  3xGND pins = 6A
  3xX1 pins = 6A
  1xX2 pins = 2A
  1xX3 pins = 2A
  1xCOM pins = 2A
- DESIGN NOTE:
  In-System Programming uses the target Atmel AVR’s internal SPI (Serial Peripheral Interface) to
  download code into the flash and EEPROM memories. Pinout and connector according to Atmel programming user guides.
- DESIGN NOTE:
  In-System Programming Interface Connector
- DESIGN NOTE:
  Current rating (per pin) depent on mated connector. Min current 4.3A and max 6.3A
- (near J5) DESIGN NOTE:
  Debugger Connector
- DESIGN NOTE:
  Terminal UART and I2C. UART TX and RX definition from this board to Host
- DESIGN NOTE:
  GPIOs Expansion Connector
- DESIGN NOTE:
  Main Connector
- DESIGN NOTE:
  Breakboard Nodes Connector
- DESIGN NOTE:
  DMM Connector
- Mounting holes 5mm pad 2.2mm drill
- BOARD MOUNTING HOLES - ONE IN EACH CORNER
- 8
- 7
- 6
- 5
- 4
- 3
- DWG. NO.
- REV.
- SHT.
- REVISION
- 2
- DESCRIPTION
- DATE
- 1
- APPROVED
- THIS DOCUMENT AND THE DATA DISCLOSED HEREIN OR HEREWITH IS THE PROPERTY OF IONOSENS AND MAY BE FREELY DISTRIBUTED IN WHOLE. ALL RIGHTS ARE RESERVED.
- F
- E
- D
- C
- B
- A
- SCALE:
- A3
- SIZE
- CAGE CODE
- DWG NO.
- SHEET
- OF
- REV

### Library data of the parts
FD1-FD3 = CMP-00028-00005-2: Fiducial - Round 1x2mm; Pins: 0
J1-J3 = J01-001-01-00001-2: Conn Socket and Terminal Strip HDR/SKT 100 POS 0.5mm Solder ST SMD T/R; Manufacturer: Samtec; Gender: HERMAPHRODITIC; Pitch: 500 µm; Contact Plating: Gold; Case/Package: SMD; Max Operating Temperature: 125°C; Number of Rows: 2; RoHS Compliant: Yes; Housing Color: Black; Mounting Technology: SMD; Pins: 100; Termination: Solder; Orientation: Straight; Depth: 4.98 mm; Length: 29.7 mm; Contact Material: Bronze; Housing Material: Polymer; Min Operating Temperature: -55°C; Manufacturer P/N: LSHM-150-06.0-L-DV-A-N-K-TR
J4 = J01-001-01-00003-2: 6 Vias Pin Header 2.54mm, Right Angle; Manufacturer: Samtec; Gender: Male; Orientation: Straight; Mounting Technology: Through Hole; Contact Material: Bronze; Housing Material: Polyester; Pitch: 2.54mm; Housing Color: Black; Termination: Solder; Min Operating Temperature: -55°C; Pins: 6; Depth: 4.87 mm; RoHS Compliant: Yes; Manufacturer P/N: TSW-103-08-F-D-RA; Length: 7.62 mm; Contact Plating: Gold; Number of Rows: 2; Max Operating Temperature: 125°C; Case/Package: Through Hole
J5 = J01-001-01-00005-2: 6 Vias Pin Header 2.54mm, Right Angle, 1 Row; Manufacturer: Samtec; Gender: Male; Mounting Technology: Through Hole; RoHS Compliant: Yes; Contact Plating: Gold; Max Operating Temperature: 125°C; Pins: 6; Housing Material: Polyester; Case/Package: Through Hole; Pitch: 2.54mm; Contact Material: Bronze; Length: 7.62 mm; Termination: Solder; Number of Rows: 2; Manufacturer P/N: HTSW-106-08-F-S-RA; Depth: 4.87 mm; Orientation: Straight; Min Operating Temperature: -55°C; Housing Color: Black
J6 = J01-001-01-00007-2: Pluggable Terminal Blocks 4 Pos 5mm pitch Thro ugh Hole Header; Manufacturer: Phoenix Contact; Gender: Male; Pitch: 5; Housing Color: Green; Orientation: Right Angle; Housing Material: Polybutylene; Number of Rows: 1; Max Operating Temperature: 125°C; Contact Material: -; Case/Package: TH; Depth: 12; Contact Plating: Tin; RoHS Compliant: Yes; Pins: 4; Termination: Solder; Mounting Technology: TH; Manufacturer P/N: 1776715; Length: 30; Min Operating Temperature: -55°C
MH1-MH4 = CMP-00028-00007-2: hole 5mm pad drill 2.2; Manufacturer: Ionosens; Manufacturer P/N: H5D22; Mounting Technology: Pad; RoHS Compliant: yes; Case/Package: Pad; Min Operating Temperature: 125°C; Pins: 1; Max Operating Temperature: -40°C

## Sheet Sheet3.SchDoc
size 420 x 297 mm
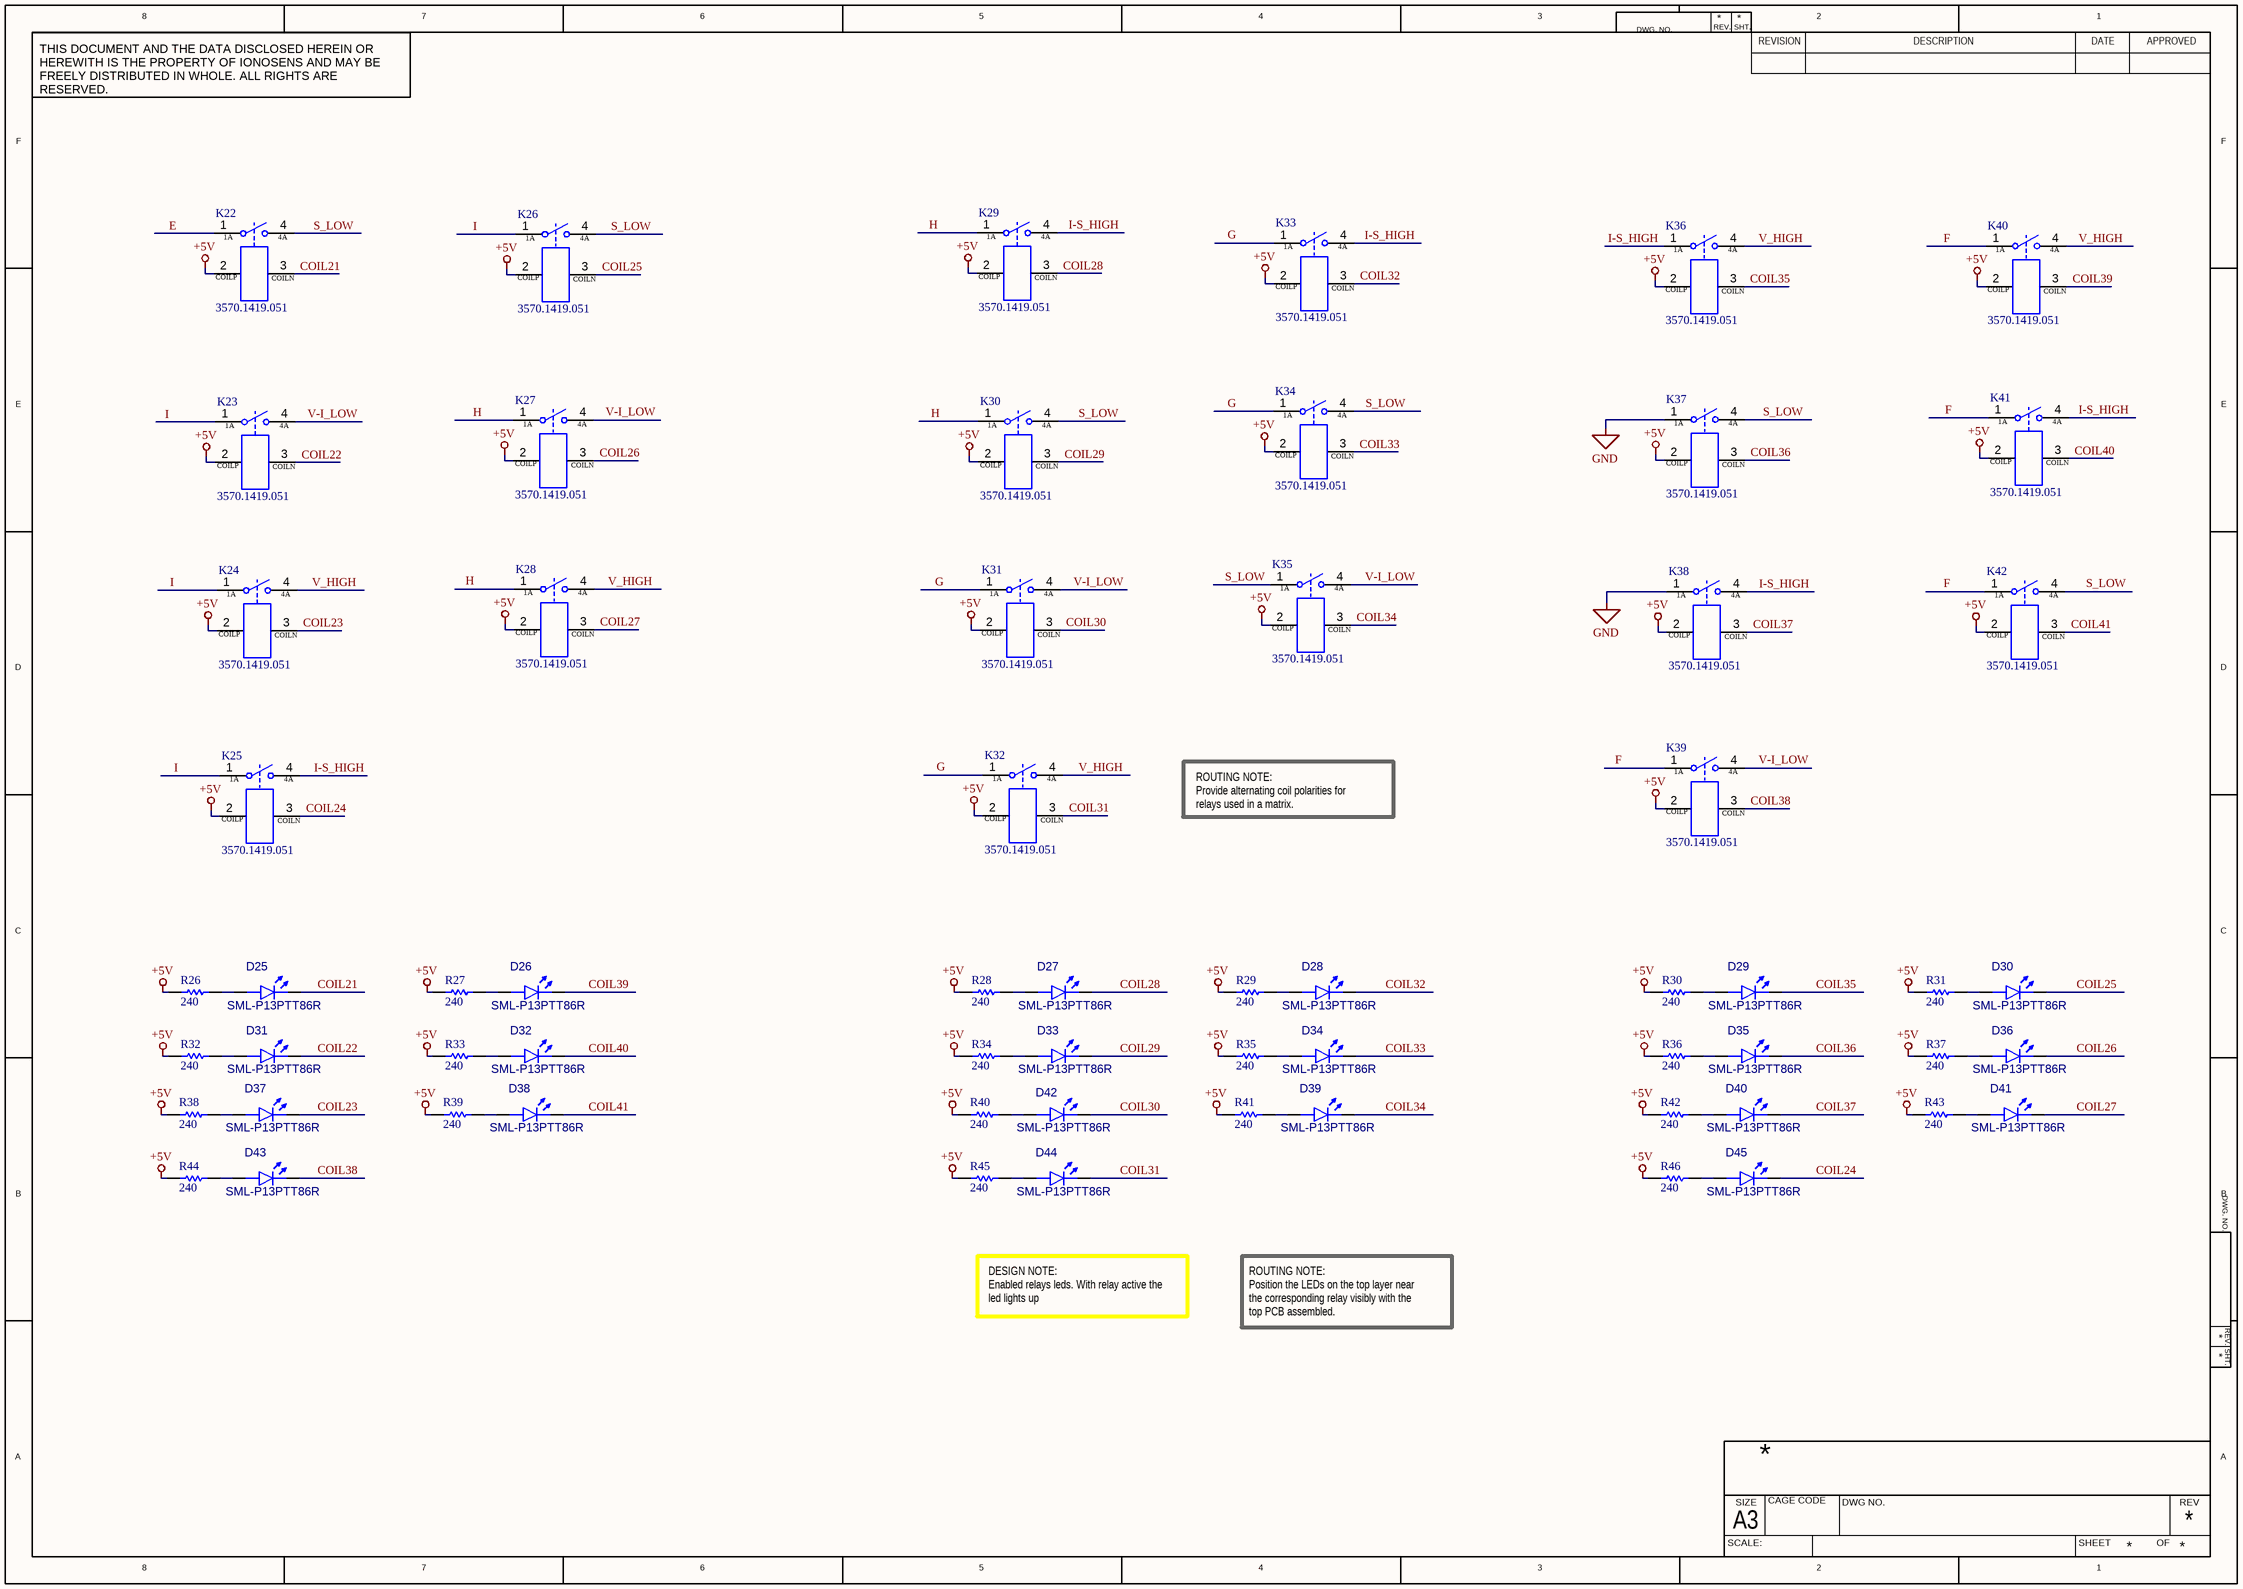
[diagram p3: Sheet3.SchDoc]

### Parts
D25  SML-P13PTT86R  [DIOC1005X02R]
D26  SML-P13PTT86R  [DIOC1005X02R]
D27  SML-P13PTT86R  [DIOC1005X02R]
D28  SML-P13PTT86R  [DIOC1005X02R]
D29  SML-P13PTT86R  [DIOC1005X02R]
D30  SML-P13PTT86R  [DIOC1005X02R]
D31  SML-P13PTT86R  [DIOC1005X02R]
D32  SML-P13PTT86R  [DIOC1005X02R]
D33  SML-P13PTT86R  [DIOC1005X02R]
D34  SML-P13PTT86R  [DIOC1005X02R]
D35  SML-P13PTT86R  [DIOC1005X02R]
D36  SML-P13PTT86R  [DIOC1005X02R]
D37  SML-P13PTT86R  [DIOC1005X02R]
D38  SML-P13PTT86R  [DIOC1005X02R]
D39  SML-P13PTT86R  [DIOC1005X02R]
D40  SML-P13PTT86R  [DIOC1005X02R]
D41  SML-P13PTT86R  [DIOC1005X02R]
D42  SML-P13PTT86R  [DIOC1005X02R]
D43  SML-P13PTT86R  [DIOC1005X02R]
D44  SML-P13PTT86R  [DIOC1005X02R]
D45  SML-P13PTT86R  [DIOC1005X02R]
K22  3570.1419.051  [3570.1419]
K23  3570.1419.051  [3570.1419]
K24  3570.1419.051  [3570.1419]
K25  3570.1419.051  [3570.1419]
K26  3570.1419.051  [3570.1419]
K27  3570.1419.051  [3570.1419]
K28  3570.1419.051  [3570.1419]
K29  3570.1419.051  [3570.1419]
K30  3570.1419.051  [3570.1419]
K31  3570.1419.051  [3570.1419]
K32  3570.1419.051  [3570.1419]
K33  3570.1419.051  [3570.1419]
K34  3570.1419.051  [3570.1419]
K35  3570.1419.051  [3570.1419]
K36  3570.1419.051  [3570.1419]
K37  3570.1419.051  [3570.1419]
K38  3570.1419.051  [3570.1419]
K39  3570.1419.051  [3570.1419]
K40  3570.1419.051  [3570.1419]
K41  3570.1419.051  [3570.1419]
K42  3570.1419.051  [3570.1419]
R26  value 240  [RESC1005X04M]  (hidden comment: AC0402FR-07240RL)
R27  value 240  [RESC1005X04M]  (hidden comment: AC0402FR-07240RL)
R28  value 240  [RESC1005X04M]  (hidden comment: AC0402FR-07240RL)
R29  value 240  [RESC1005X04M]  (hidden comment: AC0402FR-07240RL)
R30  value 240  [RESC1005X04M]  (hidden comment: AC0402FR-07240RL)
R31  value 240  [RESC1005X04M]  (hidden comment: AC0402FR-07240RL)
R32  value 240  [RESC1005X04M]  (hidden comment: AC0402FR-07240RL)
R33  value 240  [RESC1005X04M]  (hidden comment: AC0402FR-07240RL)
R34  value 240  [RESC1005X04M]  (hidden comment: AC0402FR-07240RL)
R35  value 240  [RESC1005X04M]  (hidden comment: AC0402FR-07240RL)
R36  value 240  [RESC1005X04M]  (hidden comment: AC0402FR-07240RL)
R37  value 240  [RESC1005X04M]  (hidden comment: AC0402FR-07240RL)
R38  value 240  [RESC1005X04M]  (hidden comment: AC0402FR-07240RL)
R39  value 240  [RESC1005X04M]  (hidden comment: AC0402FR-07240RL)
R40  value 240  [RESC1005X04M]  (hidden comment: AC0402FR-07240RL)
R41  value 240  [RESC1005X04M]  (hidden comment: AC0402FR-07240RL)
R42  value 240  [RESC1005X04M]  (hidden comment: AC0402FR-07240RL)
R43  value 240  [RESC1005X04M]  (hidden comment: AC0402FR-07240RL)
R44  value 240  [RESC1005X04M]  (hidden comment: AC0402FR-07240RL)
R45  value 240  [RESC1005X04M]  (hidden comment: AC0402FR-07240RL)
R46  value 240  [RESC1005X04M]  (hidden comment: AC0402FR-07240RL)

### Nets
+5V: K22.2(COILP) K23.2(COILP) K24.2(COILP) K25.2(COILP) K26.2(COILP) K27.2(COILP) K28.2(COILP) K29.2(COILP) K30.2(COILP) K31.2(COILP) K32.2(COILP) K33.2(COILP) K34.2(COILP) K35.2(COILP) K36.2(COILP) K37.2(COILP) K38.2(COILP) K39.2(COILP) K40.2(COILP) K41.2(COILP) K42.2(COILP) R26.1 R27.1 R28.1 R29.1 R30.1 R31.1 R32.1 R33.1 R34.1 R35.1 R36.1 R37.1 R38.1 R39.1 R40.1 R41.1 R42.1 R43.1 R44.1 R45.1 R46.1
GND: K37.1(1A) K38.1(1A)
COIL21: D25.1(K) K22.3(COILN)
COIL22: D31.1(K) K23.3(COILN)
COIL23: D37.1(K) K24.3(COILN)
COIL24: D45.1(K) K25.3(COILN)
COIL25: D30.1(K) K26.3(COILN)
COIL26: D36.1(K) K27.3(COILN)
COIL27: D41.1(K) K28.3(COILN)
COIL28: D27.1(K) K29.3(COILN)
COIL29: D33.1(K) K30.3(COILN)
COIL30: D42.1(K) K31.3(COILN)
COIL31: D44.1(K) K32.3(COILN)
COIL32: D28.1(K) K33.3(COILN)
COIL33: D34.1(K) K34.3(COILN)
COIL34: D39.1(K) K35.3(COILN)
COIL35: D29.1(K) K36.3(COILN)
COIL36: D35.1(K) K37.3(COILN)
COIL37: D40.1(K) K38.3(COILN)
COIL38: D43.1(K) K39.3(COILN)
COIL39: D26.1(K) K40.3(COILN)
COIL40: D32.1(K) K41.3(COILN)
COIL41: D38.1(K) K42.3(COILN)
E: K22.1(1A)
F: K39.1(1A) K40.1(1A) K41.1(1A) K42.1(1A)
G: K31.1(1A) K32.1(1A) K33.1(1A) K34.1(1A)
H: K27.1(1A) K28.1(1A) K29.1(1A) K30.1(1A)
I: K23.1(1A) K24.1(1A) K25.1(1A) K26.1(1A)
I-S_HIGH: K25.4(4A) K29.4(4A) K33.4(4A) K36.1(1A) K38.4(4A) K41.4(4A)
S_LOW: K22.4(4A) K26.4(4A) K30.4(4A) K34.4(4A) K35.1(1A) K37.4(4A) K42.4(4A)
V-I_LOW: K23.4(4A) K27.4(4A) K31.4(4A) K35.4(4A) K39.4(4A)
V_HIGH: K24.4(4A) K28.4(4A) K32.4(4A) K36.4(4A) K40.4(4A)
NetD25_2: D25.2(A) R26.2
NetD26_2: D26.2(A) R27.2
NetD27_2: D27.2(A) R28.2
NetD28_2: D28.2(A) R29.2
NetD29_2: D29.2(A) R30.2
NetD30_2: D30.2(A) R31.2
NetD31_2: D31.2(A) R32.2
NetD32_2: D32.2(A) R33.2
NetD33_2: D33.2(A) R34.2
NetD34_2: D34.2(A) R35.2
NetD35_2: D35.2(A) R36.2
NetD36_2: D36.2(A) R37.2
NetD37_2: D37.2(A) R38.2
NetD38_2: D38.2(A) R39.2
NetD39_2: D39.2(A) R41.2
NetD40_2: D40.2(A) R42.2
NetD41_2: D41.2(A) R43.2
NetD42_2: D42.2(A) R40.2
NetD43_2: D43.2(A) R44.2
NetD44_2: D44.2(A) R45.2
NetD45_2: D45.2(A) R46.2

### Notes on the sheet
- ROUTING NOTE:
  Provide alternating coil polarities for relays used in a matrix.
- DESIGN NOTE:
  Enabled relays leds. With relay active the led lights up
- ROUTING NOTE:
  Position the LEDs on the top layer near the corresponding relay visibly with the top PCB assembled.
- 8
- 7
- 6
- 5
- 4
- 3
- DWG. NO.
- REV.
- SHT.
- REVISION
- 2
- DESCRIPTION
- DATE
- 1
- APPROVED
- THIS DOCUMENT AND THE DATA DISCLOSED HEREIN OR HEREWITH IS THE PROPERTY OF IONOSENS AND MAY BE FREELY DISTRIBUTED IN WHOLE. ALL RIGHTS ARE RESERVED.
- F
- E
- D
- C
- B
- A
- SCALE:
- A3
- SIZE
- CAGE CODE
- DWG NO.
- SHEET
- OF
- REV

### Library data of the parts
D25-D45 = D01-0402-01-00000-1: as D4 on sheet Sheet2; Min Operating Temperature: -40°C; Mounting Technology: SMD; Colour: Green; Manufacturer P/N: SML-P13PTT86R; Max Operating Temperature: 85°C; Pins: 2; RoHS Compliant: Yes; Case/Package: 0402
K22-K42 = K01-0008-01-00008-1: as K1 on sheet Sheet2; Manufacturer P/N: 3570.1419.051; Mounting Technology: TH; Contact Material: -; Relay Type: Reed; Width: 15.24mm; Contact Form: 1A; Packaging: SIP; Switching Current: 1A; Pins: 4; Case/Package: SIP; Coil Type: -; Min Operating Temperature: -40°C; RoHS: Yes; Height: 6.98mm; Max Operating Temperature: 85°C
R26-R46 = R01-0402-01-00437-2: as R2 on sheet Sheet1; Packaging: Tape & Reel; Manufacturer P/N: AC0402FR-07240RL; Height: 370µm; Case/Package: 0402; Composition: Thick Film; Max Operating Temperature: 155°C; Number of Terminations: 2; RoHS: Yes; Min Operating Temperature: -55°C; Tolerance: 1%; Width: 508µm; Length: 990.6µm; Features: Automotive AEC-Q200, Moisture Resistant

## Nets that join several sheets
+5V: Sheet1 (26 pins), Sheet2 (42 pins), Sheet4 (8 pins), Sheet3 (42 pins)
GND: Sheet1 (30 pins), Sheet2 (K17.1 K18.1), Sheet4 (28 pins), Sheet3 (K37.1 K38.1)
A: Sheet2 (K1.1 K2.1 K3.1 K4.1), Sheet4 (J2.7 J3.8)
B: Sheet2 (K5.1 K6.1 K7.1 K8.1), Sheet4 (J2.9 J3.10)
C: Sheet2 (K9.1 K10.1 K11.1 K12.1), Sheet4 (J2.11 J3.12)
COIL0: Sheet1 (U2.16), Sheet2 (D4.1 K1.3)
COIL1: Sheet1 (U2.15), Sheet2 (D10.1 K2.3)
COIL2: Sheet1 (U2.11), Sheet2 (D16.1 K3.3)
COIL3: Sheet1 (U4.15), Sheet2 (D22.1 K4.3)
COIL4: Sheet1 (U4.16), Sheet2 (D5.1 K5.3)
COIL5: Sheet1 (U4.14), Sheet2 (D11.1 K6.3)
COIL6: Sheet1 (U4.13), Sheet2 (D17.1 K7.3)
COIL7: Sheet1 (U4.12), Sheet2 (D6.1 K8.3)
COIL8: Sheet1 (U4.11), Sheet2 (D12.1 K9.3)
COIL9: Sheet1 (U4.10), Sheet2 (D21.1 K10.3)
COIL10: Sheet1 (U7.16), Sheet2 (D7.1 K11.3)
COIL11: Sheet1 (U7.15), Sheet2 (D13.1 K12.3)
COIL12: Sheet1 (U7.14), Sheet2 (D18.1 K13.3)
COIL13: Sheet1 (U7.11), Sheet2 (D8.1 K14.3)
COIL14: Sheet1 (U7.10), Sheet2 (D14.1 K15.3)
COIL15: Sheet1 (U6.16), Sheet2 (D19.1 K16.3)
COIL16: Sheet1 (U7.12), Sheet2 (D24.1 K17.3)
COIL17: Sheet1 (U7.13), Sheet2 (D9.1 K18.3)
COIL18: Sheet1 (U2.14), Sheet2 (D15.1 K19.3)
COIL19: Sheet1 (U2.13), Sheet2 (D20.1 K20.3)
COIL20: Sheet1 (U2.12), Sheet2 (D23.1 K21.3)
COIL21: Sheet1 (U2.10), Sheet3 (D25.1 K22.3)
COIL22: Sheet1 (U5.10), Sheet3 (D31.1 K23.3)
COIL23: Sheet1 (U5.11), Sheet3 (D37.1 K24.3)
COIL24: Sheet1 (U5.16), Sheet3 (D45.1 K25.3)
COIL25: Sheet1 (U1.10), Sheet3 (D30.1 K26.3)
COIL26: Sheet1 (U1.11), Sheet3 (D36.1 K27.3)
COIL27: Sheet1 (U1.12), Sheet3 (D41.1 K28.3)
COIL28: Sheet1 (U1.13), Sheet3 (D27.1 K29.3)
COIL29: Sheet1 (U1.14), Sheet3 (D33.1 K30.3)
COIL30: Sheet1 (U1.15), Sheet3 (D42.1 K31.3)
COIL31: Sheet1 (U1.16), Sheet3 (D44.1 K32.3)
COIL32: Sheet1 (U6.10), Sheet3 (D28.1 K33.3)
COIL33: Sheet1 (U6.11), Sheet3 (D34.1 K34.3)
COIL34: Sheet1 (U6.12), Sheet3 (D39.1 K35.3)
COIL35: Sheet1 (U6.13), Sheet3 (D29.1 K36.3)
COIL36: Sheet1 (U6.14), Sheet3 (D35.1 K37.3)
COIL37: Sheet1 (U6.15), Sheet3 (D40.1 K38.3)
COIL38: Sheet1 (U5.12), Sheet3 (D43.1 K39.3)
COIL39: Sheet1 (U5.13), Sheet3 (D26.1 K40.3)
COIL40: Sheet1 (U5.14), Sheet3 (D32.1 K41.3)
COIL41: Sheet1 (U5.15), Sheet3 (D38.1 K42.3)
D: Sheet2 (K13.1 K14.1 K15.1 K16.1), Sheet4 (J2.13 J3.14)
E: Sheet2 (K19.1 K20.1 K21.1), Sheet4 (J2.15 J3.16), Sheet3 (K22.1)
F: Sheet4 (J2.17 J3.18), Sheet3 (K39.1 K40.1 K41.1 K42.1)
G: Sheet4 (J2.19 J3.20), Sheet3 (K31.1 K32.1 K33.1 K34.1)
GPIO1: Sheet1 (U3.46), Sheet4 (J1.100)
GPIO2: Sheet1 (U3.47), Sheet4 (J1.98)
GPIO3: Sheet1 (U3.48), Sheet4 (J1.96)
GPIO4: Sheet1 (U3.50), Sheet4 (J1.94)
GPIO5: Sheet1 (U3.49), Sheet4 (J1.92)
GPIO6: Sheet1 (U3.51), Sheet4 (J1.90)
GPIO7: Sheet1 (U3.52), Sheet4 (J1.88)
GPIO8: Sheet1 (U3.53), Sheet4 (J1.86)
GPIO9: Sheet1 (U3.54), Sheet4 (J1.84)
GPIO10: Sheet1 (U3.55), Sheet4 (J1.82)
GPIO11: Sheet1 (U3.56), Sheet4 (J1.80)
GPIO12: Sheet1 (U3.57), Sheet4 (J1.78)
GPIO13: Sheet1 (U3.58), Sheet4 (J1.76)
GPIO14: Sheet1 (U3.59), Sheet4 (J1.74)
GPIO15: Sheet1 (U3.60), Sheet4 (J1.72)
GPIO16: Sheet1 (U3.63), Sheet4 (J1.70)
GPIO17: Sheet1 (U3.64), Sheet4 (J1.68)
GPIO18: Sheet1 (U3.65), Sheet4 (J1.66)
GPIO19: Sheet1 (U3.66), Sheet4 (J1.64)
GPIO20: Sheet1 (U3.67), Sheet4 (J1.62)
GPIO21: Sheet1 (U3.68), Sheet4 (J1.60)
GPIO22: Sheet1 (U3.69), Sheet4 (J1.58)
GPIO23: Sheet1 (U3.70), Sheet4 (J1.56)
GPIO24: Sheet1 (U3.71), Sheet4 (J1.54)
GPIO25: Sheet1 (U3.72), Sheet4 (J1.52)
GPIO26: Sheet1 (U3.73), Sheet4 (J1.50)
GPIO27: Sheet1 (U3.74), Sheet4 (J1.48)
GPIO28: Sheet1 (U3.75), Sheet4 (J1.46)
GPIO29: Sheet1 (U3.76), Sheet4 (J1.44)
GPIO30: Sheet1 (U3.77), Sheet4 (J1.42)
GPIO31: Sheet1 (U3.78), Sheet4 (J1.40)
GPIO32: Sheet1 (U3.79), Sheet4 (J1.38)
GPIO33: Sheet1 (U3.82), Sheet4 (J1.36)
GPIO34: Sheet1 (U3.83), Sheet4 (J1.34)
H: Sheet4 (J2.21 J3.22), Sheet3 (K27.1 K28.1 K29.1 K30.1)
I: Sheet4 (J2.23 J3.24), Sheet3 (K23.1 K24.1 K25.1 K26.1)
I-S_HIGH: Sheet2 (5 pins), Sheet4 (J1.10 J6.1), Sheet3 (6 pins)
MISO: Sheet1 (U3.22), Sheet4 (J2.95 J4.1)
MOSI: Sheet1 (U3.21), Sheet4 (J2.97 J4.4)
RST: Sheet1 (R1.1 U3.30), Sheet4 (J4.5)
S_LOW: Sheet2 (K4.4 K8.4 K12.4 K16.4), Sheet4 (J1.2 J6.4), Sheet3 (7 pins)
SCK: Sheet1 (U3.20), Sheet4 (J2.99 J4.3)
SCL: Sheet1 (U3.43), Sheet4 (J2.8 J3.7 J5.5)
SDA: Sheet1 (U3.44), Sheet4 (J2.10 J3.9 J5.6)
SS: Sheet1 (U3.19), Sheet4 (J2.100)
V-I_LOW: Sheet2 (6 pins), Sheet4 (J1.6 J6.3), Sheet3 (5 pins)
V_HIGH: Sheet2 (6 pins), Sheet4 (J1.14 J6.2), Sheet3 (5 pins)
VIDB_RX: Sheet1 (U3.2), Sheet4 (J2.14 J5.4)
VIDB_TX: Sheet1 (U3.3), Sheet4 (J2.12 J5.2)